# EAGLE schematic ETEST01 (EAGLE 7.3.0)

## Sheet 1 of 2
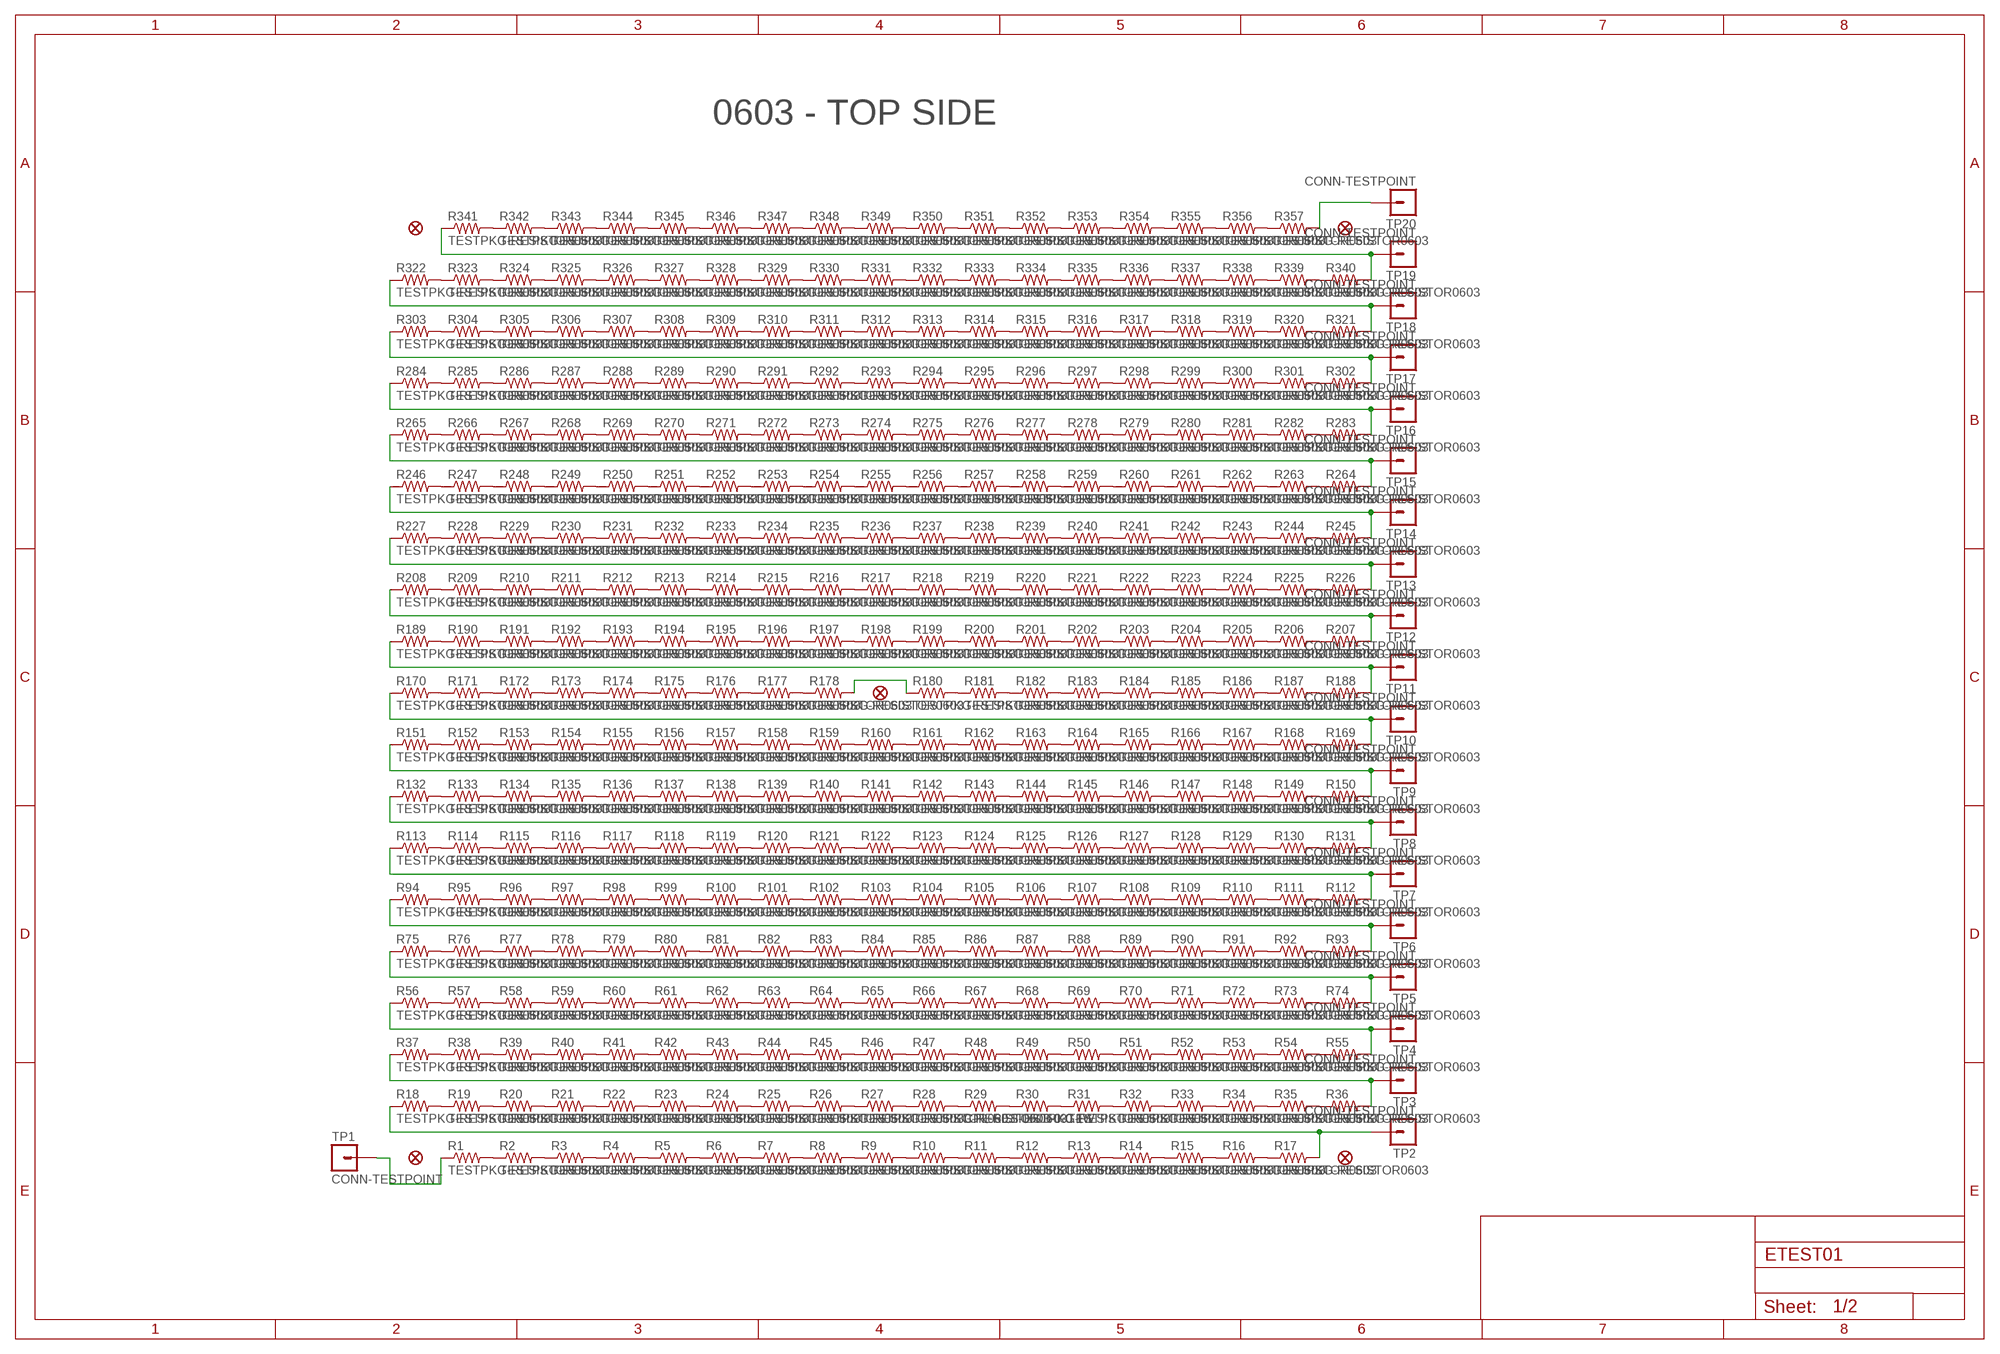
[diagram p0: schematic, sheet 1]

### Parts
FID1  FIDUCIAL  [FIDUCIAL]
FID2  FIDUCIAL  [FIDUCIAL]
FID3  FIDUCIAL  [FIDUCIAL]
FID4  FIDUCIAL  [FIDUCIAL]
FID5  FIDUCIAL  [FIDUCIAL]
R1  TESTPKG-RESISTOR0603  [TESTPKG-R0603]
R2  TESTPKG-RESISTOR0603  [TESTPKG-R0603]
R3  TESTPKG-RESISTOR0603  [TESTPKG-R0603]
R4  TESTPKG-RESISTOR0603  [TESTPKG-R0603]
R5  TESTPKG-RESISTOR0603  [TESTPKG-R0603]
R6  TESTPKG-RESISTOR0603  [TESTPKG-R0603]
R7  TESTPKG-RESISTOR0603  [TESTPKG-R0603]
R8  TESTPKG-RESISTOR0603  [TESTPKG-R0603]
R9  TESTPKG-RESISTOR0603  [TESTPKG-R0603]
R10  TESTPKG-RESISTOR0603  [TESTPKG-R0603]
R11  TESTPKG-RESISTOR0603  [TESTPKG-R0603]
R12  TESTPKG-RESISTOR0603  [TESTPKG-R0603]
R13  TESTPKG-RESISTOR0603  [TESTPKG-R0603]
R14  TESTPKG-RESISTOR0603  [TESTPKG-R0603]
R15  TESTPKG-RESISTOR0603  [TESTPKG-R0603]
R16  TESTPKG-RESISTOR0603  [TESTPKG-R0603]
R17  TESTPKG-RESISTOR0603  [TESTPKG-R0603]
R18  TESTPKG-RESISTOR0603  [TESTPKG-R0603]
R19  TESTPKG-RESISTOR0603  [TESTPKG-R0603]
R20  TESTPKG-RESISTOR0603  [TESTPKG-R0603]
R21  TESTPKG-RESISTOR0603  [TESTPKG-R0603]
R22  TESTPKG-RESISTOR0603  [TESTPKG-R0603]
R23  TESTPKG-RESISTOR0603  [TESTPKG-R0603]
R24  TESTPKG-RESISTOR0603  [TESTPKG-R0603]
R25  TESTPKG-RESISTOR0603  [TESTPKG-R0603]
R26  TESTPKG-RESISTOR0603  [TESTPKG-R0603]
R27  TESTPKG-RESISTOR0603  [TESTPKG-R0603]
R28  TESTPKG-RESISTOR0603  [TESTPKG-R0603]
R29  CPL-RES-0603-0-0.1W  [R0603]
R30  TESTPKG-RESISTOR0603  [TESTPKG-R0603]
R31  TESTPKG-RESISTOR0603  [TESTPKG-R0603]
R32  TESTPKG-RESISTOR0603  [TESTPKG-R0603]
R33  TESTPKG-RESISTOR0603  [TESTPKG-R0603]
R34  TESTPKG-RESISTOR0603  [TESTPKG-R0603]
R35  TESTPKG-RESISTOR0603  [TESTPKG-R0603]
R36  TESTPKG-RESISTOR0603  [TESTPKG-R0603]
R37  TESTPKG-RESISTOR0603  [TESTPKG-R0603]
R38  TESTPKG-RESISTOR0603  [TESTPKG-R0603]
R39  TESTPKG-RESISTOR0603  [TESTPKG-R0603]
R40  TESTPKG-RESISTOR0603  [TESTPKG-R0603]
R41  TESTPKG-RESISTOR0603  [TESTPKG-R0603]
R42  TESTPKG-RESISTOR0603  [TESTPKG-R0603]
R43  TESTPKG-RESISTOR0603  [TESTPKG-R0603]
R44  TESTPKG-RESISTOR0603  [TESTPKG-R0603]
R45  TESTPKG-RESISTOR0603  [TESTPKG-R0603]
R46  TESTPKG-RESISTOR0603  [TESTPKG-R0603]
R47  TESTPKG-RESISTOR0603  [TESTPKG-R0603]
R48  TESTPKG-RESISTOR0603  [TESTPKG-R0603]
R49  TESTPKG-RESISTOR0603  [TESTPKG-R0603]
R50  TESTPKG-RESISTOR0603  [TESTPKG-R0603]
R51  TESTPKG-RESISTOR0603  [TESTPKG-R0603]
R52  TESTPKG-RESISTOR0603  [TESTPKG-R0603]
R53  TESTPKG-RESISTOR0603  [TESTPKG-R0603]
R54  TESTPKG-RESISTOR0603  [TESTPKG-R0603]
R55  TESTPKG-RESISTOR0603  [TESTPKG-R0603]
R56  TESTPKG-RESISTOR0603  [TESTPKG-R0603]
R57  TESTPKG-RESISTOR0603  [TESTPKG-R0603]
R58  TESTPKG-RESISTOR0603  [TESTPKG-R0603]
R59  TESTPKG-RESISTOR0603  [TESTPKG-R0603]
R60  TESTPKG-RESISTOR0603  [TESTPKG-R0603]
R61  TESTPKG-RESISTOR0603  [TESTPKG-R0603]
R62  TESTPKG-RESISTOR0603  [TESTPKG-R0603]
R63  TESTPKG-RESISTOR0603  [TESTPKG-R0603]
R64  TESTPKG-RESISTOR0603  [TESTPKG-R0603]
R65  TESTPKG-RESISTOR0603  [TESTPKG-R0603]
R66  TESTPKG-RESISTOR0603  [TESTPKG-R0603]
R67  TESTPKG-RESISTOR0603  [TESTPKG-R0603]
R68  TESTPKG-RESISTOR0603  [TESTPKG-R0603]
R69  TESTPKG-RESISTOR0603  [TESTPKG-R0603]
R70  TESTPKG-RESISTOR0603  [TESTPKG-R0603]
R71  TESTPKG-RESISTOR0603  [TESTPKG-R0603]
R72  TESTPKG-RESISTOR0603  [TESTPKG-R0603]
R73  TESTPKG-RESISTOR0603  [TESTPKG-R0603]
R74  TESTPKG-RESISTOR0603  [TESTPKG-R0603]
R75  TESTPKG-RESISTOR0603  [TESTPKG-R0603]
R76  TESTPKG-RESISTOR0603  [TESTPKG-R0603]
R77  TESTPKG-RESISTOR0603  [TESTPKG-R0603]
R78  TESTPKG-RESISTOR0603  [TESTPKG-R0603]
R79  TESTPKG-RESISTOR0603  [TESTPKG-R0603]
R80  TESTPKG-RESISTOR0603  [TESTPKG-R0603]
R81  TESTPKG-RESISTOR0603  [TESTPKG-R0603]
R82  TESTPKG-RESISTOR0603  [TESTPKG-R0603]
R83  TESTPKG-RESISTOR0603  [TESTPKG-R0603]
R84  TESTPKG-RESISTOR0603  [TESTPKG-R0603]
R85  TESTPKG-RESISTOR0603  [TESTPKG-R0603]
R86  TESTPKG-RESISTOR0603  [TESTPKG-R0603]
R87  TESTPKG-RESISTOR0603  [TESTPKG-R0603]
R88  TESTPKG-RESISTOR0603  [TESTPKG-R0603]
R89  TESTPKG-RESISTOR0603  [TESTPKG-R0603]
R90  TESTPKG-RESISTOR0603  [TESTPKG-R0603]
R91  TESTPKG-RESISTOR0603  [TESTPKG-R0603]
R92  TESTPKG-RESISTOR0603  [TESTPKG-R0603]
R93  TESTPKG-RESISTOR0603  [TESTPKG-R0603]
R94  TESTPKG-RESISTOR0603  [TESTPKG-R0603]
R95  TESTPKG-RESISTOR0603  [TESTPKG-R0603]
R96  TESTPKG-RESISTOR0603  [TESTPKG-R0603]
R97  TESTPKG-RESISTOR0603  [TESTPKG-R0603]
R98  TESTPKG-RESISTOR0603  [TESTPKG-R0603]
R99  TESTPKG-RESISTOR0603  [TESTPKG-R0603]
R100  TESTPKG-RESISTOR0603  [TESTPKG-R0603]
R101  TESTPKG-RESISTOR0603  [TESTPKG-R0603]
R102  TESTPKG-RESISTOR0603  [TESTPKG-R0603]
R103  TESTPKG-RESISTOR0603  [TESTPKG-R0603]
R104  TESTPKG-RESISTOR0603  [TESTPKG-R0603]
R105  TESTPKG-RESISTOR0603  [TESTPKG-R0603]
R106  TESTPKG-RESISTOR0603  [TESTPKG-R0603]
R107  TESTPKG-RESISTOR0603  [TESTPKG-R0603]
R108  TESTPKG-RESISTOR0603  [TESTPKG-R0603]
R109  TESTPKG-RESISTOR0603  [TESTPKG-R0603]
R110  TESTPKG-RESISTOR0603  [TESTPKG-R0603]
R111  TESTPKG-RESISTOR0603  [TESTPKG-R0603]
R112  TESTPKG-RESISTOR0603  [TESTPKG-R0603]
R113  TESTPKG-RESISTOR0603  [TESTPKG-R0603]
R114  TESTPKG-RESISTOR0603  [TESTPKG-R0603]
R115  TESTPKG-RESISTOR0603  [TESTPKG-R0603]
R116  TESTPKG-RESISTOR0603  [TESTPKG-R0603]
R117  TESTPKG-RESISTOR0603  [TESTPKG-R0603]
R118  TESTPKG-RESISTOR0603  [TESTPKG-R0603]
R119  TESTPKG-RESISTOR0603  [TESTPKG-R0603]
R120  TESTPKG-RESISTOR0603  [TESTPKG-R0603]
R121  TESTPKG-RESISTOR0603  [TESTPKG-R0603]
R122  TESTPKG-RESISTOR0603  [TESTPKG-R0603]
R123  TESTPKG-RESISTOR0603  [TESTPKG-R0603]
R124  TESTPKG-RESISTOR0603  [TESTPKG-R0603]
R125  TESTPKG-RESISTOR0603  [TESTPKG-R0603]
R126  TESTPKG-RESISTOR0603  [TESTPKG-R0603]
R127  TESTPKG-RESISTOR0603  [TESTPKG-R0603]
R128  TESTPKG-RESISTOR0603  [TESTPKG-R0603]
R129  TESTPKG-RESISTOR0603  [TESTPKG-R0603]
R130  TESTPKG-RESISTOR0603  [TESTPKG-R0603]
R131  TESTPKG-RESISTOR0603  [TESTPKG-R0603]
R132  TESTPKG-RESISTOR0603  [TESTPKG-R0603]
R133  TESTPKG-RESISTOR0603  [TESTPKG-R0603]
R134  TESTPKG-RESISTOR0603  [TESTPKG-R0603]
R135  TESTPKG-RESISTOR0603  [TESTPKG-R0603]
R136  TESTPKG-RESISTOR0603  [TESTPKG-R0603]
R137  TESTPKG-RESISTOR0603  [TESTPKG-R0603]
R138  TESTPKG-RESISTOR0603  [TESTPKG-R0603]
R139  TESTPKG-RESISTOR0603  [TESTPKG-R0603]
R140  TESTPKG-RESISTOR0603  [TESTPKG-R0603]
R141  TESTPKG-RESISTOR0603  [TESTPKG-R0603]
R142  TESTPKG-RESISTOR0603  [TESTPKG-R0603]
R143  TESTPKG-RESISTOR0603  [TESTPKG-R0603]
R144  TESTPKG-RESISTOR0603  [TESTPKG-R0603]
R145  TESTPKG-RESISTOR0603  [TESTPKG-R0603]
R146  TESTPKG-RESISTOR0603  [TESTPKG-R0603]
R147  TESTPKG-RESISTOR0603  [TESTPKG-R0603]
R148  TESTPKG-RESISTOR0603  [TESTPKG-R0603]
R149  TESTPKG-RESISTOR0603  [TESTPKG-R0603]
R150  TESTPKG-RESISTOR0603  [TESTPKG-R0603]
R151  TESTPKG-RESISTOR0603  [TESTPKG-R0603]
R152  TESTPKG-RESISTOR0603  [TESTPKG-R0603]
R153  TESTPKG-RESISTOR0603  [TESTPKG-R0603]
R154  TESTPKG-RESISTOR0603  [TESTPKG-R0603]
R155  TESTPKG-RESISTOR0603  [TESTPKG-R0603]
R156  TESTPKG-RESISTOR0603  [TESTPKG-R0603]
R157  TESTPKG-RESISTOR0603  [TESTPKG-R0603]
R158  TESTPKG-RESISTOR0603  [TESTPKG-R0603]
R159  TESTPKG-RESISTOR0603  [TESTPKG-R0603]
R160  TESTPKG-RESISTOR0603  [TESTPKG-R0603]
R161  TESTPKG-RESISTOR0603  [TESTPKG-R0603]
R162  TESTPKG-RESISTOR0603  [TESTPKG-R0603]
R163  TESTPKG-RESISTOR0603  [TESTPKG-R0603]
R164  TESTPKG-RESISTOR0603  [TESTPKG-R0603]
R165  TESTPKG-RESISTOR0603  [TESTPKG-R0603]
R166  TESTPKG-RESISTOR0603  [TESTPKG-R0603]
R167  TESTPKG-RESISTOR0603  [TESTPKG-R0603]
R168  TESTPKG-RESISTOR0603  [TESTPKG-R0603]
R169  TESTPKG-RESISTOR0603  [TESTPKG-R0603]
R170  TESTPKG-RESISTOR0603  [TESTPKG-R0603]
R171  TESTPKG-RESISTOR0603  [TESTPKG-R0603]
R172  TESTPKG-RESISTOR0603  [TESTPKG-R0603]
R173  TESTPKG-RESISTOR0603  [TESTPKG-R0603]
R174  TESTPKG-RESISTOR0603  [TESTPKG-R0603]
R175  TESTPKG-RESISTOR0603  [TESTPKG-R0603]
R176  TESTPKG-RESISTOR0603  [TESTPKG-R0603]
R177  TESTPKG-RESISTOR0603  [TESTPKG-R0603]
R178  TESTPKG-RESISTOR0603  [TESTPKG-R0603]
R180  TESTPKG-RESISTOR0603  [TESTPKG-R0603]
R181  TESTPKG-RESISTOR0603  [TESTPKG-R0603]
R182  TESTPKG-RESISTOR0603  [TESTPKG-R0603]
R183  TESTPKG-RESISTOR0603  [TESTPKG-R0603]
R184  TESTPKG-RESISTOR0603  [TESTPKG-R0603]
R185  TESTPKG-RESISTOR0603  [TESTPKG-R0603]
R186  TESTPKG-RESISTOR0603  [TESTPKG-R0603]
R187  TESTPKG-RESISTOR0603  [TESTPKG-R0603]
R188  TESTPKG-RESISTOR0603  [TESTPKG-R0603]
R189  TESTPKG-RESISTOR0603  [TESTPKG-R0603]
R190  TESTPKG-RESISTOR0603  [TESTPKG-R0603]
R191  TESTPKG-RESISTOR0603  [TESTPKG-R0603]
R192  TESTPKG-RESISTOR0603  [TESTPKG-R0603]
R193  TESTPKG-RESISTOR0603  [TESTPKG-R0603]
R194  TESTPKG-RESISTOR0603  [TESTPKG-R0603]
R195  TESTPKG-RESISTOR0603  [TESTPKG-R0603]
R196  TESTPKG-RESISTOR0603  [TESTPKG-R0603]
R197  TESTPKG-RESISTOR0603  [TESTPKG-R0603]
R198  TESTPKG-RESISTOR0603  [TESTPKG-R0603]
R199  TESTPKG-RESISTOR0603  [TESTPKG-R0603]
R200  TESTPKG-RESISTOR0603  [TESTPKG-R0603]
R201  TESTPKG-RESISTOR0603  [TESTPKG-R0603]
R202  TESTPKG-RESISTOR0603  [TESTPKG-R0603]
R203  TESTPKG-RESISTOR0603  [TESTPKG-R0603]
R204  TESTPKG-RESISTOR0603  [TESTPKG-R0603]
R205  TESTPKG-RESISTOR0603  [TESTPKG-R0603]
R206  TESTPKG-RESISTOR0603  [TESTPKG-R0603]
R207  TESTPKG-RESISTOR0603  [TESTPKG-R0603]
R208  TESTPKG-RESISTOR0603  [TESTPKG-R0603]
R209  TESTPKG-RESISTOR0603  [TESTPKG-R0603]
R210  TESTPKG-RESISTOR0603  [TESTPKG-R0603]
R211  TESTPKG-RESISTOR0603  [TESTPKG-R0603]
R212  TESTPKG-RESISTOR0603  [TESTPKG-R0603]
R213  TESTPKG-RESISTOR0603  [TESTPKG-R0603]
R214  TESTPKG-RESISTOR0603  [TESTPKG-R0603]
R215  TESTPKG-RESISTOR0603  [TESTPKG-R0603]
R216  TESTPKG-RESISTOR0603  [TESTPKG-R0603]
R217  TESTPKG-RESISTOR0603  [TESTPKG-R0603]
R218  TESTPKG-RESISTOR0603  [TESTPKG-R0603]
R219  TESTPKG-RESISTOR0603  [TESTPKG-R0603]
R220  TESTPKG-RESISTOR0603  [TESTPKG-R0603]
R221  TESTPKG-RESISTOR0603  [TESTPKG-R0603]
R222  TESTPKG-RESISTOR0603  [TESTPKG-R0603]
R223  TESTPKG-RESISTOR0603  [TESTPKG-R0603]
R224  TESTPKG-RESISTOR0603  [TESTPKG-R0603]
R225  TESTPKG-RESISTOR0603  [TESTPKG-R0603]
R226  TESTPKG-RESISTOR0603  [TESTPKG-R0603]
R227  TESTPKG-RESISTOR0603  [TESTPKG-R0603]
R228  TESTPKG-RESISTOR0603  [TESTPKG-R0603]
R229  TESTPKG-RESISTOR0603  [TESTPKG-R0603]
R230  TESTPKG-RESISTOR0603  [TESTPKG-R0603]
R231  TESTPKG-RESISTOR0603  [TESTPKG-R0603]
R232  TESTPKG-RESISTOR0603  [TESTPKG-R0603]
R233  TESTPKG-RESISTOR0603  [TESTPKG-R0603]
R234  TESTPKG-RESISTOR0603  [TESTPKG-R0603]
R235  TESTPKG-RESISTOR0603  [TESTPKG-R0603]
R236  TESTPKG-RESISTOR0603  [TESTPKG-R0603]
R237  TESTPKG-RESISTOR0603  [TESTPKG-R0603]
R238  TESTPKG-RESISTOR0603  [TESTPKG-R0603]
R239  TESTPKG-RESISTOR0603  [TESTPKG-R0603]
R240  TESTPKG-RESISTOR0603  [TESTPKG-R0603]
R241  TESTPKG-RESISTOR0603  [TESTPKG-R0603]
R242  TESTPKG-RESISTOR0603  [TESTPKG-R0603]
R243  TESTPKG-RESISTOR0603  [TESTPKG-R0603]
R244  TESTPKG-RESISTOR0603  [TESTPKG-R0603]
R245  TESTPKG-RESISTOR0603  [TESTPKG-R0603]
R246  TESTPKG-RESISTOR0603  [TESTPKG-R0603]
R247  TESTPKG-RESISTOR0603  [TESTPKG-R0603]
R248  TESTPKG-RESISTOR0603  [TESTPKG-R0603]
R249  TESTPKG-RESISTOR0603  [TESTPKG-R0603]
R250  TESTPKG-RESISTOR0603  [TESTPKG-R0603]
R251  TESTPKG-RESISTOR0603  [TESTPKG-R0603]
R252  TESTPKG-RESISTOR0603  [TESTPKG-R0603]
R253  TESTPKG-RESISTOR0603  [TESTPKG-R0603]
R254  TESTPKG-RESISTOR0603  [TESTPKG-R0603]
R255  TESTPKG-RESISTOR0603  [TESTPKG-R0603]
R256  TESTPKG-RESISTOR0603  [TESTPKG-R0603]
R257  TESTPKG-RESISTOR0603  [TESTPKG-R0603]
R258  TESTPKG-RESISTOR0603  [TESTPKG-R0603]
R259  TESTPKG-RESISTOR0603  [TESTPKG-R0603]
R260  TESTPKG-RESISTOR0603  [TESTPKG-R0603]
R261  TESTPKG-RESISTOR0603  [TESTPKG-R0603]
R262  TESTPKG-RESISTOR0603  [TESTPKG-R0603]
R263  TESTPKG-RESISTOR0603  [TESTPKG-R0603]
R264  TESTPKG-RESISTOR0603  [TESTPKG-R0603]
R265  TESTPKG-RESISTOR0603  [TESTPKG-R0603]
R266  TESTPKG-RESISTOR0603  [TESTPKG-R0603]
R267  TESTPKG-RESISTOR0603  [TESTPKG-R0603]
R268  TESTPKG-RESISTOR0603  [TESTPKG-R0603]
R269  TESTPKG-RESISTOR0603  [TESTPKG-R0603]
R270  TESTPKG-RESISTOR0603  [TESTPKG-R0603]
R271  TESTPKG-RESISTOR0603  [TESTPKG-R0603]
R272  TESTPKG-RESISTOR0603  [TESTPKG-R0603]
R273  TESTPKG-RESISTOR0603  [TESTPKG-R0603]
R274  TESTPKG-RESISTOR0603  [TESTPKG-R0603]
R275  TESTPKG-RESISTOR0603  [TESTPKG-R0603]
R276  TESTPKG-RESISTOR0603  [TESTPKG-R0603]
R277  TESTPKG-RESISTOR0603  [TESTPKG-R0603]
R278  TESTPKG-RESISTOR0603  [TESTPKG-R0603]
R279  TESTPKG-RESISTOR0603  [TESTPKG-R0603]
R280  TESTPKG-RESISTOR0603  [TESTPKG-R0603]
R281  TESTPKG-RESISTOR0603  [TESTPKG-R0603]
R282  TESTPKG-RESISTOR0603  [TESTPKG-R0603]
R283  TESTPKG-RESISTOR0603  [TESTPKG-R0603]
R284  TESTPKG-RESISTOR0603  [TESTPKG-R0603]
R285  TESTPKG-RESISTOR0603  [TESTPKG-R0603]
R286  TESTPKG-RESISTOR0603  [TESTPKG-R0603]
R287  TESTPKG-RESISTOR0603  [TESTPKG-R0603]
R288  TESTPKG-RESISTOR0603  [TESTPKG-R0603]
R289  TESTPKG-RESISTOR0603  [TESTPKG-R0603]
R290  TESTPKG-RESISTOR0603  [TESTPKG-R0603]
R291  TESTPKG-RESISTOR0603  [TESTPKG-R0603]
R292  TESTPKG-RESISTOR0603  [TESTPKG-R0603]
R293  TESTPKG-RESISTOR0603  [TESTPKG-R0603]
R294  TESTPKG-RESISTOR0603  [TESTPKG-R0603]
R295  TESTPKG-RESISTOR0603  [TESTPKG-R0603]
R296  TESTPKG-RESISTOR0603  [TESTPKG-R0603]
R297  TESTPKG-RESISTOR0603  [TESTPKG-R0603]
R298  TESTPKG-RESISTOR0603  [TESTPKG-R0603]
R299  TESTPKG-RESISTOR0603  [TESTPKG-R0603]
R300  TESTPKG-RESISTOR0603  [TESTPKG-R0603]
R301  TESTPKG-RESISTOR0603  [TESTPKG-R0603]
R302  TESTPKG-RESISTOR0603  [TESTPKG-R0603]
R303  TESTPKG-RESISTOR0603  [TESTPKG-R0603]
R304  TESTPKG-RESISTOR0603  [TESTPKG-R0603]
R305  TESTPKG-RESISTOR0603  [TESTPKG-R0603]
R306  TESTPKG-RESISTOR0603  [TESTPKG-R0603]
R307  TESTPKG-RESISTOR0603  [TESTPKG-R0603]
R308  TESTPKG-RESISTOR0603  [TESTPKG-R0603]
R309  TESTPKG-RESISTOR0603  [TESTPKG-R0603]
R310  TESTPKG-RESISTOR0603  [TESTPKG-R0603]
R311  TESTPKG-RESISTOR0603  [TESTPKG-R0603]
R312  TESTPKG-RESISTOR0603  [TESTPKG-R0603]
R313  TESTPKG-RESISTOR0603  [TESTPKG-R0603]
R314  TESTPKG-RESISTOR0603  [TESTPKG-R0603]
R315  TESTPKG-RESISTOR0603  [TESTPKG-R0603]
R316  TESTPKG-RESISTOR0603  [TESTPKG-R0603]
R317  TESTPKG-RESISTOR0603  [TESTPKG-R0603]
R318  TESTPKG-RESISTOR0603  [TESTPKG-R0603]
R319  TESTPKG-RESISTOR0603  [TESTPKG-R0603]
R320  TESTPKG-RESISTOR0603  [TESTPKG-R0603]
R321  TESTPKG-RESISTOR0603  [TESTPKG-R0603]
R322  TESTPKG-RESISTOR0603  [TESTPKG-R0603]
R323  TESTPKG-RESISTOR0603  [TESTPKG-R0603]
R324  TESTPKG-RESISTOR0603  [TESTPKG-R0603]
R325  TESTPKG-RESISTOR0603  [TESTPKG-R0603]
R326  TESTPKG-RESISTOR0603  [TESTPKG-R0603]
R327  TESTPKG-RESISTOR0603  [TESTPKG-R0603]
R328  TESTPKG-RESISTOR0603  [TESTPKG-R0603]
R329  TESTPKG-RESISTOR0603  [TESTPKG-R0603]
R330  TESTPKG-RESISTOR0603  [TESTPKG-R0603]
R331  TESTPKG-RESISTOR0603  [TESTPKG-R0603]
R332  TESTPKG-RESISTOR0603  [TESTPKG-R0603]
R333  TESTPKG-RESISTOR0603  [TESTPKG-R0603]
R334  TESTPKG-RESISTOR0603  [TESTPKG-R0603]
R335  TESTPKG-RESISTOR0603  [TESTPKG-R0603]
R336  TESTPKG-RESISTOR0603  [TESTPKG-R0603]
R337  TESTPKG-RESISTOR0603  [TESTPKG-R0603]
R338  TESTPKG-RESISTOR0603  [TESTPKG-R0603]
R339  TESTPKG-RESISTOR0603  [TESTPKG-R0603]
R340  TESTPKG-RESISTOR0603  [TESTPKG-R0603]
R341  TESTPKG-RESISTOR0603  [TESTPKG-R0603]
R342  TESTPKG-RESISTOR0603  [TESTPKG-R0603]
R343  TESTPKG-RESISTOR0603  [TESTPKG-R0603]
R344  TESTPKG-RESISTOR0603  [TESTPKG-R0603]
R345  TESTPKG-RESISTOR0603  [TESTPKG-R0603]
R346  TESTPKG-RESISTOR0603  [TESTPKG-R0603]
R347  TESTPKG-RESISTOR0603  [TESTPKG-R0603]
R348  TESTPKG-RESISTOR0603  [TESTPKG-R0603]
R349  TESTPKG-RESISTOR0603  [TESTPKG-R0603]
R350  TESTPKG-RESISTOR0603  [TESTPKG-R0603]
R351  TESTPKG-RESISTOR0603  [TESTPKG-R0603]
R352  TESTPKG-RESISTOR0603  [TESTPKG-R0603]
R353  TESTPKG-RESISTOR0603  [TESTPKG-R0603]
R354  TESTPKG-RESISTOR0603  [TESTPKG-R0603]
R355  TESTPKG-RESISTOR0603  [TESTPKG-R0603]
R356  TESTPKG-RESISTOR0603  [TESTPKG-R0603]
R357  TESTPKG-RESISTOR0603  [TESTPKG-R0603]
TP1  CONN-TESTPOINT  [CON-TESTPOINT]
TP2  CONN-TESTPOINT  [CON-TESTPOINT]
TP3  CONN-TESTPOINT  [CON-TESTPOINT]
TP4  CONN-TESTPOINT  [CON-TESTPOINT]
TP5  CONN-TESTPOINT  [CON-TESTPOINT]
TP6  CONN-TESTPOINT  [CON-TESTPOINT]
TP7  CONN-TESTPOINT  [CON-TESTPOINT]
TP8  CONN-TESTPOINT  [CON-TESTPOINT]
TP9  CONN-TESTPOINT  [CON-TESTPOINT]
TP10  CONN-TESTPOINT  [CON-TESTPOINT]
TP11  CONN-TESTPOINT  [CON-TESTPOINT]
TP12  CONN-TESTPOINT  [CON-TESTPOINT]
TP13  CONN-TESTPOINT  [CON-TESTPOINT]
TP14  CONN-TESTPOINT  [CON-TESTPOINT]
TP15  CONN-TESTPOINT  [CON-TESTPOINT]
TP16  CONN-TESTPOINT  [CON-TESTPOINT]
TP17  CONN-TESTPOINT  [CON-TESTPOINT]
TP18  CONN-TESTPOINT  [CON-TESTPOINT]
TP19  CONN-TESTPOINT  [CON-TESTPOINT]
TP20  CONN-TESTPOINT  [CON-TESTPOINT]

### Nets
N$1: R228.2 R229.1
N$2: R226.2 R227.1 TP13.1
N$3: R225.2 R226.1
N$4: R224.2 R225.1
N$5: R223.2 R224.1
N$6: R222.2 R223.1
N$7: R221.2 R222.1
N$8: R220.2 R221.1
N$9: R219.2 R220.1
N$10: R218.2 R219.1
N$11: R217.2 R218.1
N$12: R216.2 R217.1
N$13: R215.2 R216.1
N$14: R214.2 R215.1
N$15: R213.2 R214.1
N$16: R212.2 R213.1
N$17: R342.2 R343.1
N$18: R211.2 R212.1
N$19: R210.2 R211.1
N$20: R209.2 R210.1
N$21: R207.2 R208.1 TP12.1
N$22: R206.2 R207.1
N$23: R205.2 R206.1
N$24: R204.2 R205.1
N$25: R203.2 R204.1
N$26: R202.2 R203.1
N$27: R201.2 R202.1
N$28: R200.2 R201.1
N$29: R199.2 R200.1
N$30: R198.2 R199.1
N$31: R197.2 R198.1
N$32: R196.2 R197.1
N$33: R195.2 R196.1
N$34: R194.2 R195.1
N$35: R193.2 R194.1
N$36: R192.2 R193.1
N$37: R191.2 R192.1
N$38: R190.2 R191.1
N$39: R188.2 R189.1 TP11.1
N$40: R187.2 R188.1
N$41: R186.2 R187.1
N$42: R185.2 R186.1
N$43: R184.2 R185.1
N$44: R183.2 R184.1
N$45: R182.2 R183.1
N$46: R181.2 R182.1
N$47: R180.2 R181.1
N$48: R178.2 R180.1
N$49: R357.2 TP20.1
N$50: R177.2 R178.1
N$51: R176.2 R177.1
N$52: R175.2 R176.1
N$53: R174.2 R175.1
N$54: R173.2 R174.1
N$55: R172.2 R173.1
N$56: R171.2 R172.1
N$57: R169.2 R170.1 TP10.1
N$58: R168.2 R169.1
N$59: R167.2 R168.1
N$60: R166.2 R167.1
N$61: R165.2 R166.1
N$62: R164.2 R165.1
N$63: R163.2 R164.1
N$64: R162.2 R163.1
N$65: R161.2 R162.1
N$66: R160.2 R161.1
N$67: R159.2 R160.1
N$68: R158.2 R159.1
N$69: R157.2 R158.1
N$70: R156.2 R157.1
N$71: R155.2 R156.1
N$72: R154.2 R155.1
N$73: R153.2 R154.1
N$74: R152.2 R153.1
N$75: R150.2 R151.1 TP9.1
N$76: R149.2 R150.1
N$77: R148.2 R149.1
N$78: R147.2 R148.1
N$79: R146.2 R147.1
N$80: R145.2 R146.1
N$81: R144.2 R145.1
N$82: R143.2 R144.1
N$83: R142.2 R143.1
N$84: R141.2 R142.1
N$85: R140.2 R141.1
N$86: R139.2 R140.1
N$87: R138.2 R139.1
N$88: R137.2 R138.1
N$89: R136.2 R137.1
N$90: R135.2 R136.1
N$91: R134.2 R135.1
N$92: R133.2 R134.1
N$93: R131.2 R132.1 TP8.1
N$94: R130.2 R131.1
N$95: R129.2 R130.1
N$96: R128.2 R129.1
N$97: R127.2 R128.1
N$98: R126.2 R127.1
N$99: R125.2 R126.1
N$100: R124.2 R125.1
N$101: R123.2 R124.1
N$102: R122.2 R123.1
N$103: R121.2 R122.1
N$104: R120.2 R121.1
N$105: R119.2 R120.1
N$106: R118.2 R119.1
N$107: R117.2 R118.1
N$108: R116.2 R117.1
N$109: R115.2 R116.1
N$110: R114.2 R115.1
N$111: R112.2 R113.1 TP7.1
N$112: R111.2 R112.1
N$113: R110.2 R111.1
N$114: R109.2 R110.1
N$115: R108.2 R109.1
N$116: R107.2 R108.1
N$117: R106.2 R107.1
N$118: R105.2 R106.1
N$119: R104.2 R105.1
N$120: R103.2 R104.1
N$121: R102.2 R103.1
N$122: R101.2 R102.1
N$123: R100.2 R101.1
N$124: R99.2 R100.1
N$125: R98.2 R99.1
N$126: R97.2 R98.1
N$127: R96.2 R97.1
N$128: R95.2 R96.1
N$129: R93.2 R94.1 TP6.1
N$130: R92.2 R93.1
N$131: R91.2 R92.1
N$132: R90.2 R91.1
N$133: R89.2 R90.1
N$134: R88.2 R89.1
N$135: R87.2 R88.1
N$136: R86.2 R87.1
N$137: R85.2 R86.1
N$138: R84.2 R85.1
N$139: R83.2 R84.1
N$140: R82.2 R83.1
N$141: R81.2 R82.1
N$142: R80.2 R81.1
N$143: R79.2 R80.1
N$144: R78.2 R79.1
N$145: R77.2 R78.1
N$146: R76.2 R77.1
N$147: R75.2 R76.1
N$148: R73.2 R74.1
N$149: R72.2 R73.1
N$150: R71.2 R72.1
N$151: R70.2 R71.1
N$152: R69.2 R70.1
N$153: R68.2 R69.1
N$154: R67.2 R68.1
N$155: R66.2 R67.1
N$156: R65.2 R66.1
N$157: R64.2 R65.1
N$158: R63.2 R64.1
N$159: R62.2 R63.1
N$160: R61.2 R62.1
N$161: R60.2 R61.1
N$162: R59.2 R60.1
N$163: R58.2 R59.1
N$164: R57.2 R58.1
N$165: R56.2 R57.1
N$166: R54.2 R55.1
N$167: R53.2 R54.1
N$168: R52.2 R53.1
N$169: R51.2 R52.1
N$170: R50.2 R51.1
N$171: R49.2 R50.1
N$172: R48.2 R49.1
N$173: R47.2 R48.1
N$174: R46.2 R47.1
N$175: R45.2 R46.1
N$176: R44.2 R45.1
N$177: R43.2 R44.1
N$178: R42.2 R43.1
N$179: R41.2 R42.1
N$180: R40.2 R41.1
N$181: R39.2 R40.1
N$182: R38.2 R39.1
N$183: R37.2 R38.1
N$184: R35.2 R36.1
N$185: R34.2 R35.1
N$186: R33.2 R34.1
N$187: R32.2 R33.1
N$188: R31.2 R32.1
N$189: R30.2 R31.1
N$190: R29.2 R30.1
N$191: R28.2 R29.1
N$192: R27.2 R28.1
N$193: R26.2 R27.1
N$194: R25.2 R26.1
N$195: R24.2 R25.1
N$196: R23.2 R24.1
N$197: R22.2 R23.1
N$198: R21.2 R22.1
N$199: R20.2 R21.1
N$200: R19.2 R20.1
N$201: R18.2 R19.1
N$202: R16.2 R17.1
N$203: R15.2 R16.1
N$204: R14.2 R15.1
N$205: R13.2 R14.1
N$206: R12.2 R13.1
N$207: R11.2 R12.1
N$208: R10.2 R11.1
N$209: R9.2 R10.1
N$210: R8.2 R9.1
N$211: R7.2 R8.1
N$212: R6.2 R7.1
N$213: R5.2 R6.1
N$214: R4.2 R5.1
N$215: R3.2 R4.1
N$216: R2.2 R3.1
N$217: R229.2 R230.1
N$218: R343.2 R344.1
N$219: R344.2 R345.1
N$220: R345.2 R346.1
N$221: R346.2 R347.1
N$222: R347.2 R348.1
N$223: R348.2 R349.1
N$224: R349.2 R350.1
N$225: R350.2 R351.1
N$226: R351.2 R352.1
N$227: R352.2 R353.1
N$228: R353.2 R354.1
N$229: R354.2 R355.1
N$230: R355.2 R356.1
N$231: R356.2 R357.1
N$232: R74.2 R75.1 TP5.1
N$233: R324.2 R325.1
N$234: R325.2 R326.1
N$235: R326.2 R327.1
N$236: R327.2 R328.1
N$237: R328.2 R329.1
N$238: R329.2 R330.1
N$239: R330.2 R331.1
N$240: R331.2 R332.1
N$241: R332.2 R333.1
N$242: R333.2 R334.1
N$243: R334.2 R335.1
N$244: R335.2 R336.1
N$245: R336.2 R337.1
N$246: R337.2 R338.1
N$247: R338.2 R339.1
N$248: R339.2 R340.1
N$249: R340.2 R341.1 TP19.1
N$250: R323.2 R324.1
N$251: R306.2 R307.1
N$252: R305.2 R306.1
N$253: R307.2 R308.1
N$254: R308.2 R309.1
N$255: R309.2 R310.1
N$256: R310.2 R311.1
N$257: R311.2 R312.1
N$258: R312.2 R313.1
N$259: R313.2 R314.1
N$260: R314.2 R315.1
N$261: R315.2 R316.1
N$262: R316.2 R317.1
N$263: R317.2 R318.1
N$264: R318.2 R319.1
N$265: R319.2 R320.1
N$266: R320.2 R321.1
N$267: R321.2 R322.1 TP18.1
N$268: R304.2 R305.1
N$269: R285.2 R286.1
N$270: R280.2 R281.1
N$271: R281.2 R282.1
N$272: R282.2 R283.1
N$273: R273.2 R274.1
N$274: R274.2 R275.1
N$275: R275.2 R276.1
N$276: R276.2 R277.1
N$277: R277.2 R278.1
N$278: R278.2 R279.1
N$279: R279.2 R280.1
N$280: R268.2 R269.1
N$281: R269.2 R270.1
N$282: R270.2 R271.1
N$283: R271.2 R272.1
N$284: R272.2 R273.1
N$285: R267.2 R268.1
N$286: R283.2 R284.1 TP16.1
N$287: R286.2 R287.1
N$288: R287.2 R288.1
N$289: R288.2 R289.1
N$290: R289.2 R290.1
N$291: R290.2 R291.1
N$292: R291.2 R292.1
N$293: R292.2 R293.1
N$294: R293.2 R294.1
N$295: R294.2 R295.1
N$296: R295.2 R296.1
N$297: R296.2 R297.1
N$298: R297.2 R298.1
N$299: R298.2 R299.1
N$300: R299.2 R300.1
N$301: R300.2 R301.1
N$302: R301.2 R302.1
N$303: R302.2 R303.1 TP17.1
N$304: R266.2 R267.1
N$305: R264.2 R265.1 TP15.1
N$306: R263.2 R264.1
N$307: R262.2 R263.1
N$308: R261.2 R262.1
N$309: R260.2 R261.1
N$310: R259.2 R260.1
N$311: R258.2 R259.1
N$312: R257.2 R258.1
N$313: R256.2 R257.1
N$314: R255.2 R256.1
N$315: R254.2 R255.1
N$316: R253.2 R254.1
N$317: R252.2 R253.1
N$318: R251.2 R252.1
N$319: R250.2 R251.1
N$320: R249.2 R250.1
N$321: R248.2 R249.1
N$322: R247.2 R248.1
N$323: R245.2 R246.1 TP14.1
N$324: R244.2 R245.1
N$325: R243.2 R244.1
N$326: R242.2 R243.1
N$327: R241.2 R242.1
N$328: R240.2 R241.1
N$329: R239.2 R240.1
N$330: R238.2 R239.1
N$331: R237.2 R238.1
N$332: R236.2 R237.1
N$333: R235.2 R236.1
N$334: R234.2 R235.1
N$335: R233.2 R234.1
N$336: R232.2 R233.1
N$337: R231.2 R232.1
N$338: R230.2 R231.1
N$339: R1.2 R2.1
N$340: R94.2 R95.1
N$341: R113.2 R114.1
N$342: R132.2 R133.1
N$343: R151.2 R152.1
N$344: R170.2 R171.1
N$345: R189.2 R190.1
N$346: R208.2 R209.1
N$347: R227.2 R228.1
N$348: R246.2 R247.1
N$349: R265.2 R266.1
N$350: R284.2 R285.1
N$351: R303.2 R304.1
N$352: R322.2 R323.1
N$353: R341.2 R342.1
N$354: R55.2 R56.1 TP4.1
N$355: R36.2 R37.1 TP3.1
N$356: R17.2 R18.1 TP2.1
N$357: R1.1 TP1.1

### Notes on the sheet
- 0603 - TOP SIDE

## Sheet 2 of 2
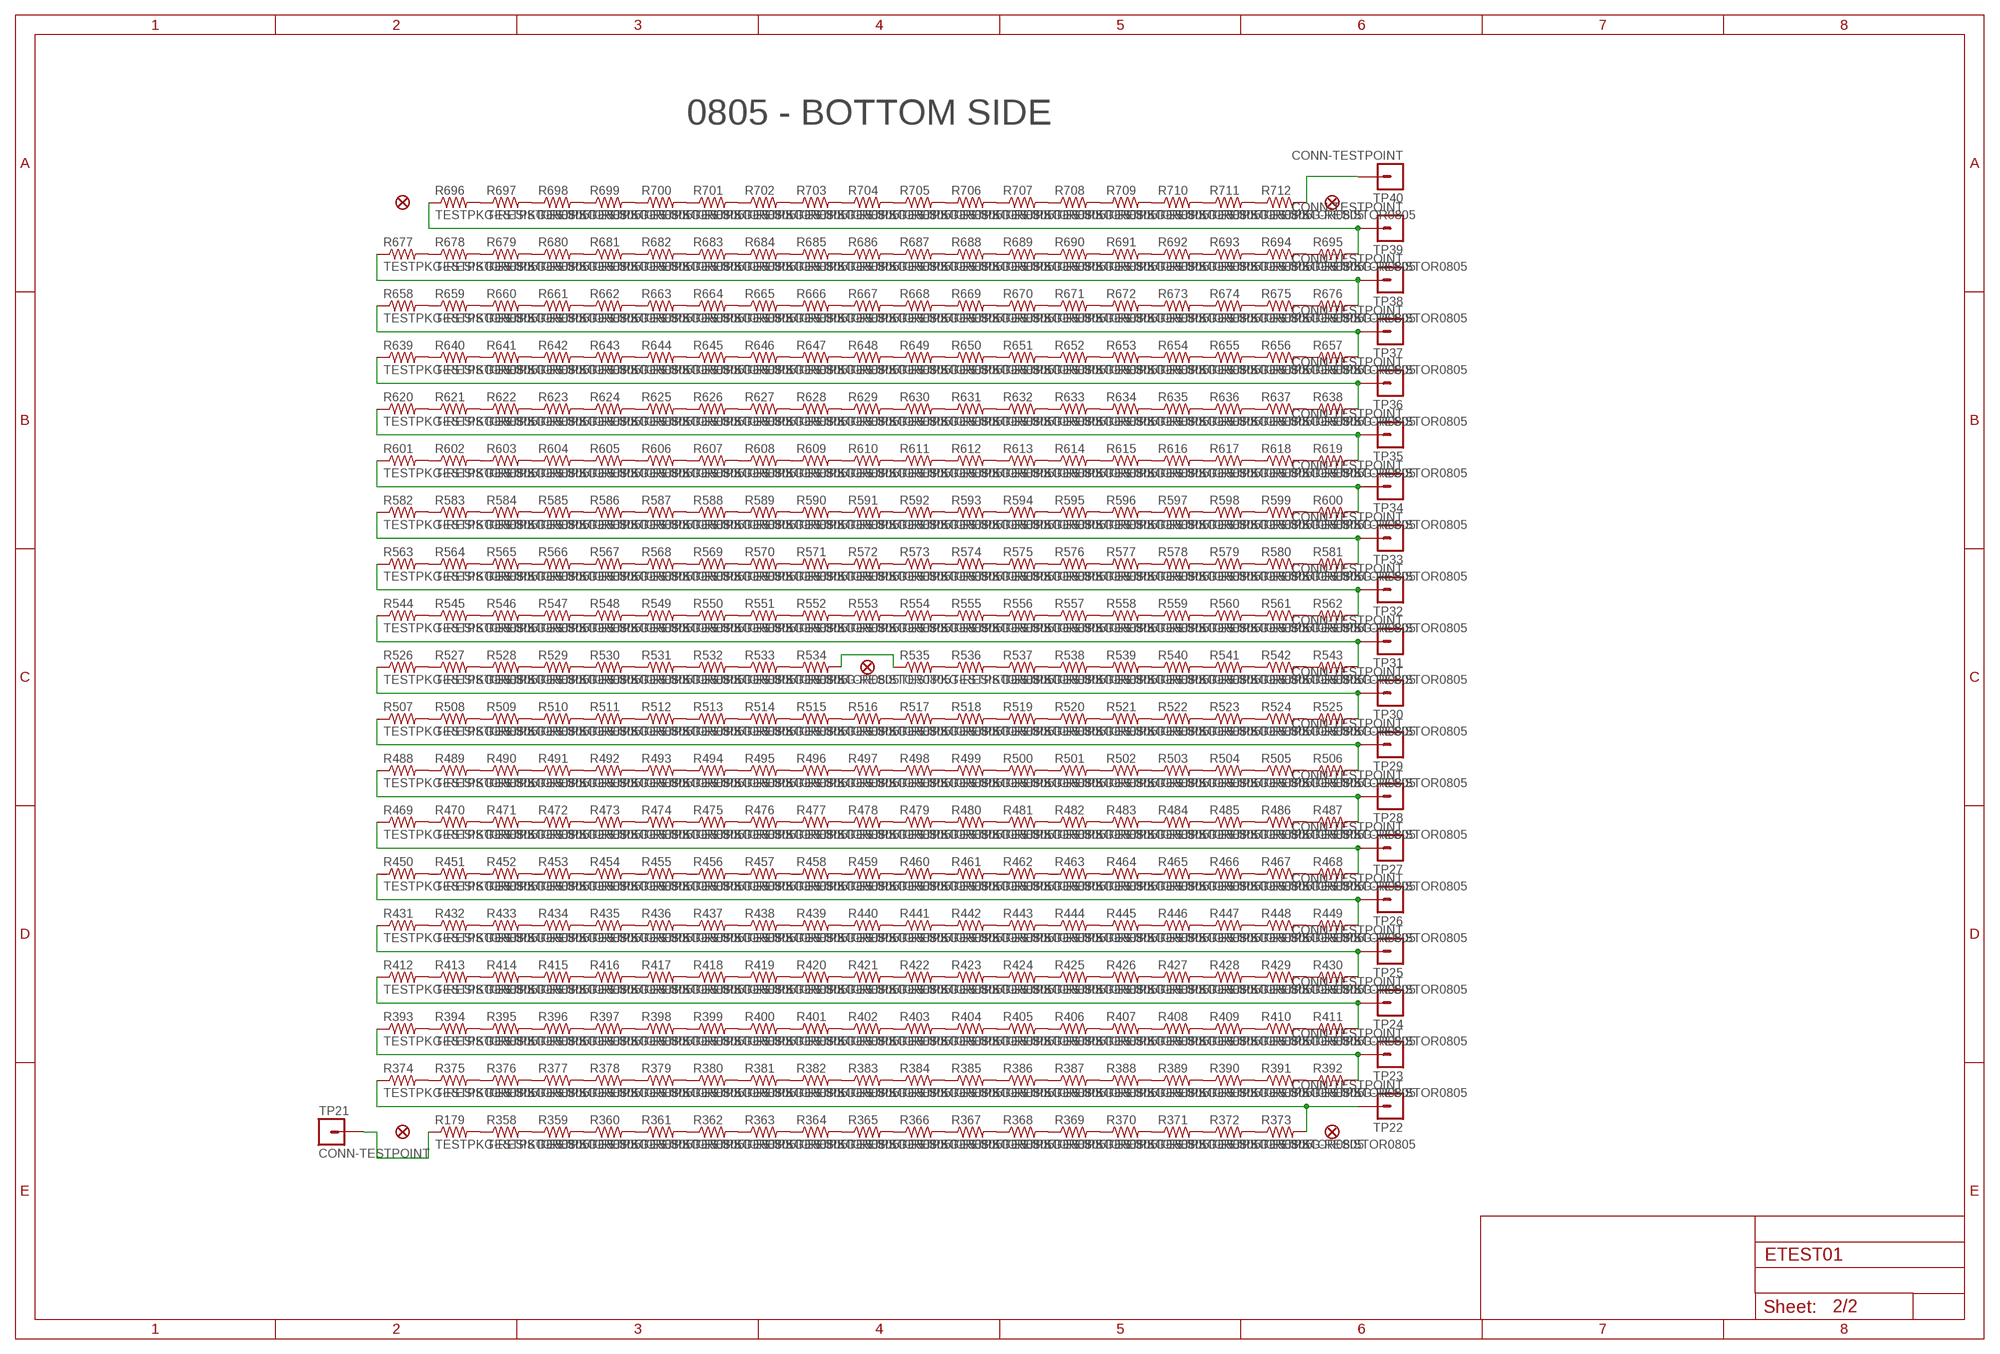
[diagram p1: schematic, sheet 2]

### Parts
FID6  FIDUCIAL  [FIDUCIAL]
FID7  FIDUCIAL  [FIDUCIAL]
FID8  FIDUCIAL  [FIDUCIAL]
FID9  FIDUCIAL  [FIDUCIAL]
FID10  FIDUCIAL  [FIDUCIAL]
R179  TESTPKG-RESISTOR0805  [TESTPKG-R0805]
R358  TESTPKG-RESISTOR0805  [TESTPKG-R0805]
R359  TESTPKG-RESISTOR0805  [TESTPKG-R0805]
R360  TESTPKG-RESISTOR0805  [TESTPKG-R0805]
R361  TESTPKG-RESISTOR0805  [TESTPKG-R0805]
R362  TESTPKG-RESISTOR0805  [TESTPKG-R0805]
R363  TESTPKG-RESISTOR0805  [TESTPKG-R0805]
R364  TESTPKG-RESISTOR0805  [TESTPKG-R0805]
R365  TESTPKG-RESISTOR0805  [TESTPKG-R0805]
R366  TESTPKG-RESISTOR0805  [TESTPKG-R0805]
R367  TESTPKG-RESISTOR0805  [TESTPKG-R0805]
R368  TESTPKG-RESISTOR0805  [TESTPKG-R0805]
R369  TESTPKG-RESISTOR0805  [TESTPKG-R0805]
R370  TESTPKG-RESISTOR0805  [TESTPKG-R0805]
R371  TESTPKG-RESISTOR0805  [TESTPKG-R0805]
R372  TESTPKG-RESISTOR0805  [TESTPKG-R0805]
R373  TESTPKG-RESISTOR0805  [TESTPKG-R0805]
R374  TESTPKG-RESISTOR0805  [TESTPKG-R0805]
R375  TESTPKG-RESISTOR0805  [TESTPKG-R0805]
R376  TESTPKG-RESISTOR0805  [TESTPKG-R0805]
R377  TESTPKG-RESISTOR0805  [TESTPKG-R0805]
R378  TESTPKG-RESISTOR0805  [TESTPKG-R0805]
R379  TESTPKG-RESISTOR0805  [TESTPKG-R0805]
R380  TESTPKG-RESISTOR0805  [TESTPKG-R0805]
R381  TESTPKG-RESISTOR0805  [TESTPKG-R0805]
R382  TESTPKG-RESISTOR0805  [TESTPKG-R0805]
R383  TESTPKG-RESISTOR0805  [TESTPKG-R0805]
R384  TESTPKG-RESISTOR0805  [TESTPKG-R0805]
R385  TESTPKG-RESISTOR0805  [TESTPKG-R0805]
R386  TESTPKG-RESISTOR0805  [TESTPKG-R0805]
R387  TESTPKG-RESISTOR0805  [TESTPKG-R0805]
R388  TESTPKG-RESISTOR0805  [TESTPKG-R0805]
R389  TESTPKG-RESISTOR0805  [TESTPKG-R0805]
R390  TESTPKG-RESISTOR0805  [TESTPKG-R0805]
R391  TESTPKG-RESISTOR0805  [TESTPKG-R0805]
R392  TESTPKG-RESISTOR0805  [TESTPKG-R0805]
R393  TESTPKG-RESISTOR0805  [TESTPKG-R0805]
R394  TESTPKG-RESISTOR0805  [TESTPKG-R0805]
R395  TESTPKG-RESISTOR0805  [TESTPKG-R0805]
R396  TESTPKG-RESISTOR0805  [TESTPKG-R0805]
R397  TESTPKG-RESISTOR0805  [TESTPKG-R0805]
R398  TESTPKG-RESISTOR0805  [TESTPKG-R0805]
R399  TESTPKG-RESISTOR0805  [TESTPKG-R0805]
R400  TESTPKG-RESISTOR0805  [TESTPKG-R0805]
R401  TESTPKG-RESISTOR0805  [TESTPKG-R0805]
R402  TESTPKG-RESISTOR0805  [TESTPKG-R0805]
R403  TESTPKG-RESISTOR0805  [TESTPKG-R0805]
R404  TESTPKG-RESISTOR0805  [TESTPKG-R0805]
R405  TESTPKG-RESISTOR0805  [TESTPKG-R0805]
R406  TESTPKG-RESISTOR0805  [TESTPKG-R0805]
R407  TESTPKG-RESISTOR0805  [TESTPKG-R0805]
R408  TESTPKG-RESISTOR0805  [TESTPKG-R0805]
R409  TESTPKG-RESISTOR0805  [TESTPKG-R0805]
R410  TESTPKG-RESISTOR0805  [TESTPKG-R0805]
R411  TESTPKG-RESISTOR0805  [TESTPKG-R0805]
R412  TESTPKG-RESISTOR0805  [TESTPKG-R0805]
R413  TESTPKG-RESISTOR0805  [TESTPKG-R0805]
R414  TESTPKG-RESISTOR0805  [TESTPKG-R0805]
R415  TESTPKG-RESISTOR0805  [TESTPKG-R0805]
R416  TESTPKG-RESISTOR0805  [TESTPKG-R0805]
R417  TESTPKG-RESISTOR0805  [TESTPKG-R0805]
R418  TESTPKG-RESISTOR0805  [TESTPKG-R0805]
R419  TESTPKG-RESISTOR0805  [TESTPKG-R0805]
R420  TESTPKG-RESISTOR0805  [TESTPKG-R0805]
R421  TESTPKG-RESISTOR0805  [TESTPKG-R0805]
R422  TESTPKG-RESISTOR0805  [TESTPKG-R0805]
R423  TESTPKG-RESISTOR0805  [TESTPKG-R0805]
R424  TESTPKG-RESISTOR0805  [TESTPKG-R0805]
R425  TESTPKG-RESISTOR0805  [TESTPKG-R0805]
R426  TESTPKG-RESISTOR0805  [TESTPKG-R0805]
R427  TESTPKG-RESISTOR0805  [TESTPKG-R0805]
R428  TESTPKG-RESISTOR0805  [TESTPKG-R0805]
R429  TESTPKG-RESISTOR0805  [TESTPKG-R0805]
R430  TESTPKG-RESISTOR0805  [TESTPKG-R0805]
R431  TESTPKG-RESISTOR0805  [TESTPKG-R0805]
R432  TESTPKG-RESISTOR0805  [TESTPKG-R0805]
R433  TESTPKG-RESISTOR0805  [TESTPKG-R0805]
R434  TESTPKG-RESISTOR0805  [TESTPKG-R0805]
R435  TESTPKG-RESISTOR0805  [TESTPKG-R0805]
R436  TESTPKG-RESISTOR0805  [TESTPKG-R0805]
R437  TESTPKG-RESISTOR0805  [TESTPKG-R0805]
R438  TESTPKG-RESISTOR0805  [TESTPKG-R0805]
R439  TESTPKG-RESISTOR0805  [TESTPKG-R0805]
R440  TESTPKG-RESISTOR0805  [TESTPKG-R0805]
R441  TESTPKG-RESISTOR0805  [TESTPKG-R0805]
R442  TESTPKG-RESISTOR0805  [TESTPKG-R0805]
R443  TESTPKG-RESISTOR0805  [TESTPKG-R0805]
R444  TESTPKG-RESISTOR0805  [TESTPKG-R0805]
R445  TESTPKG-RESISTOR0805  [TESTPKG-R0805]
R446  TESTPKG-RESISTOR0805  [TESTPKG-R0805]
R447  TESTPKG-RESISTOR0805  [TESTPKG-R0805]
R448  TESTPKG-RESISTOR0805  [TESTPKG-R0805]
R449  TESTPKG-RESISTOR0805  [TESTPKG-R0805]
R450  TESTPKG-RESISTOR0805  [TESTPKG-R0805]
R451  TESTPKG-RESISTOR0805  [TESTPKG-R0805]
R452  TESTPKG-RESISTOR0805  [TESTPKG-R0805]
R453  TESTPKG-RESISTOR0805  [TESTPKG-R0805]
R454  TESTPKG-RESISTOR0805  [TESTPKG-R0805]
R455  TESTPKG-RESISTOR0805  [TESTPKG-R0805]
R456  TESTPKG-RESISTOR0805  [TESTPKG-R0805]
R457  TESTPKG-RESISTOR0805  [TESTPKG-R0805]
R458  TESTPKG-RESISTOR0805  [TESTPKG-R0805]
R459  TESTPKG-RESISTOR0805  [TESTPKG-R0805]
R460  TESTPKG-RESISTOR0805  [TESTPKG-R0805]
R461  TESTPKG-RESISTOR0805  [TESTPKG-R0805]
R462  TESTPKG-RESISTOR0805  [TESTPKG-R0805]
R463  TESTPKG-RESISTOR0805  [TESTPKG-R0805]
R464  TESTPKG-RESISTOR0805  [TESTPKG-R0805]
R465  TESTPKG-RESISTOR0805  [TESTPKG-R0805]
R466  TESTPKG-RESISTOR0805  [TESTPKG-R0805]
R467  TESTPKG-RESISTOR0805  [TESTPKG-R0805]
R468  TESTPKG-RESISTOR0805  [TESTPKG-R0805]
R469  TESTPKG-RESISTOR0805  [TESTPKG-R0805]
R470  TESTPKG-RESISTOR0805  [TESTPKG-R0805]
R471  TESTPKG-RESISTOR0805  [TESTPKG-R0805]
R472  TESTPKG-RESISTOR0805  [TESTPKG-R0805]
R473  TESTPKG-RESISTOR0805  [TESTPKG-R0805]
R474  TESTPKG-RESISTOR0805  [TESTPKG-R0805]
R475  TESTPKG-RESISTOR0805  [TESTPKG-R0805]
R476  TESTPKG-RESISTOR0805  [TESTPKG-R0805]
R477  TESTPKG-RESISTOR0805  [TESTPKG-R0805]
R478  TESTPKG-RESISTOR0805  [TESTPKG-R0805]
R479  TESTPKG-RESISTOR0805  [TESTPKG-R0805]
R480  TESTPKG-RESISTOR0805  [TESTPKG-R0805]
R481  TESTPKG-RESISTOR0805  [TESTPKG-R0805]
R482  TESTPKG-RESISTOR0805  [TESTPKG-R0805]
R483  TESTPKG-RESISTOR0805  [TESTPKG-R0805]
R484  TESTPKG-RESISTOR0805  [TESTPKG-R0805]
R485  TESTPKG-RESISTOR0805  [TESTPKG-R0805]
R486  TESTPKG-RESISTOR0805  [TESTPKG-R0805]
R487  TESTPKG-RESISTOR0805  [TESTPKG-R0805]
R488  TESTPKG-RESISTOR0805  [TESTPKG-R0805]
R489  TESTPKG-RESISTOR0805  [TESTPKG-R0805]
R490  TESTPKG-RESISTOR0805  [TESTPKG-R0805]
R491  TESTPKG-RESISTOR0805  [TESTPKG-R0805]
R492  TESTPKG-RESISTOR0805  [TESTPKG-R0805]
R493  TESTPKG-RESISTOR0805  [TESTPKG-R0805]
R494  TESTPKG-RESISTOR0805  [TESTPKG-R0805]
R495  TESTPKG-RESISTOR0805  [TESTPKG-R0805]
R496  TESTPKG-RESISTOR0805  [TESTPKG-R0805]
R497  TESTPKG-RESISTOR0805  [TESTPKG-R0805]
R498  TESTPKG-RESISTOR0805  [TESTPKG-R0805]
R499  TESTPKG-RESISTOR0805  [TESTPKG-R0805]
R500  TESTPKG-RESISTOR0805  [TESTPKG-R0805]
R501  TESTPKG-RESISTOR0805  [TESTPKG-R0805]
R502  TESTPKG-RESISTOR0805  [TESTPKG-R0805]
R503  TESTPKG-RESISTOR0805  [TESTPKG-R0805]
R504  TESTPKG-RESISTOR0805  [TESTPKG-R0805]
R505  TESTPKG-RESISTOR0805  [TESTPKG-R0805]
R506  TESTPKG-RESISTOR0805  [TESTPKG-R0805]
R507  TESTPKG-RESISTOR0805  [TESTPKG-R0805]
R508  TESTPKG-RESISTOR0805  [TESTPKG-R0805]
R509  TESTPKG-RESISTOR0805  [TESTPKG-R0805]
R510  TESTPKG-RESISTOR0805  [TESTPKG-R0805]
R511  TESTPKG-RESISTOR0805  [TESTPKG-R0805]
R512  TESTPKG-RESISTOR0805  [TESTPKG-R0805]
R513  TESTPKG-RESISTOR0805  [TESTPKG-R0805]
R514  TESTPKG-RESISTOR0805  [TESTPKG-R0805]
R515  TESTPKG-RESISTOR0805  [TESTPKG-R0805]
R516  TESTPKG-RESISTOR0805  [TESTPKG-R0805]
R517  TESTPKG-RESISTOR0805  [TESTPKG-R0805]
R518  TESTPKG-RESISTOR0805  [TESTPKG-R0805]
R519  TESTPKG-RESISTOR0805  [TESTPKG-R0805]
R520  TESTPKG-RESISTOR0805  [TESTPKG-R0805]
R521  TESTPKG-RESISTOR0805  [TESTPKG-R0805]
R522  TESTPKG-RESISTOR0805  [TESTPKG-R0805]
R523  TESTPKG-RESISTOR0805  [TESTPKG-R0805]
R524  TESTPKG-RESISTOR0805  [TESTPKG-R0805]
R525  TESTPKG-RESISTOR0805  [TESTPKG-R0805]
R526  TESTPKG-RESISTOR0805  [TESTPKG-R0805]
R527  TESTPKG-RESISTOR0805  [TESTPKG-R0805]
R528  TESTPKG-RESISTOR0805  [TESTPKG-R0805]
R529  TESTPKG-RESISTOR0805  [TESTPKG-R0805]
R530  TESTPKG-RESISTOR0805  [TESTPKG-R0805]
R531  TESTPKG-RESISTOR0805  [TESTPKG-R0805]
R532  TESTPKG-RESISTOR0805  [TESTPKG-R0805]
R533  TESTPKG-RESISTOR0805  [TESTPKG-R0805]
R534  TESTPKG-RESISTOR0805  [TESTPKG-R0805]
R535  TESTPKG-RESISTOR0805  [TESTPKG-R0805]
R536  TESTPKG-RESISTOR0805  [TESTPKG-R0805]
R537  TESTPKG-RESISTOR0805  [TESTPKG-R0805]
R538  TESTPKG-RESISTOR0805  [TESTPKG-R0805]
R539  TESTPKG-RESISTOR0805  [TESTPKG-R0805]
R540  TESTPKG-RESISTOR0805  [TESTPKG-R0805]
R541  TESTPKG-RESISTOR0805  [TESTPKG-R0805]
R542  TESTPKG-RESISTOR0805  [TESTPKG-R0805]
R543  TESTPKG-RESISTOR0805  [TESTPKG-R0805]
R544  TESTPKG-RESISTOR0805  [TESTPKG-R0805]
R545  TESTPKG-RESISTOR0805  [TESTPKG-R0805]
R546  TESTPKG-RESISTOR0805  [TESTPKG-R0805]
R547  TESTPKG-RESISTOR0805  [TESTPKG-R0805]
R548  TESTPKG-RESISTOR0805  [TESTPKG-R0805]
R549  TESTPKG-RESISTOR0805  [TESTPKG-R0805]
R550  TESTPKG-RESISTOR0805  [TESTPKG-R0805]
R551  TESTPKG-RESISTOR0805  [TESTPKG-R0805]
R552  TESTPKG-RESISTOR0805  [TESTPKG-R0805]
R553  TESTPKG-RESISTOR0805  [TESTPKG-R0805]
R554  TESTPKG-RESISTOR0805  [TESTPKG-R0805]
R555  TESTPKG-RESISTOR0805  [TESTPKG-R0805]
R556  TESTPKG-RESISTOR0805  [TESTPKG-R0805]
R557  TESTPKG-RESISTOR0805  [TESTPKG-R0805]
R558  TESTPKG-RESISTOR0805  [TESTPKG-R0805]
R559  TESTPKG-RESISTOR0805  [TESTPKG-R0805]
R560  TESTPKG-RESISTOR0805  [TESTPKG-R0805]
R561  TESTPKG-RESISTOR0805  [TESTPKG-R0805]
R562  TESTPKG-RESISTOR0805  [TESTPKG-R0805]
R563  TESTPKG-RESISTOR0805  [TESTPKG-R0805]
R564  TESTPKG-RESISTOR0805  [TESTPKG-R0805]
R565  TESTPKG-RESISTOR0805  [TESTPKG-R0805]
R566  TESTPKG-RESISTOR0805  [TESTPKG-R0805]
R567  TESTPKG-RESISTOR0805  [TESTPKG-R0805]
R568  TESTPKG-RESISTOR0805  [TESTPKG-R0805]
R569  TESTPKG-RESISTOR0805  [TESTPKG-R0805]
R570  TESTPKG-RESISTOR0805  [TESTPKG-R0805]
R571  TESTPKG-RESISTOR0805  [TESTPKG-R0805]
R572  TESTPKG-RESISTOR0805  [TESTPKG-R0805]
R573  TESTPKG-RESISTOR0805  [TESTPKG-R0805]
R574  TESTPKG-RESISTOR0805  [TESTPKG-R0805]
R575  TESTPKG-RESISTOR0805  [TESTPKG-R0805]
R576  TESTPKG-RESISTOR0805  [TESTPKG-R0805]
R577  TESTPKG-RESISTOR0805  [TESTPKG-R0805]
R578  TESTPKG-RESISTOR0805  [TESTPKG-R0805]
R579  TESTPKG-RESISTOR0805  [TESTPKG-R0805]
R580  TESTPKG-RESISTOR0805  [TESTPKG-R0805]
R581  TESTPKG-RESISTOR0805  [TESTPKG-R0805]
R582  TESTPKG-RESISTOR0805  [TESTPKG-R0805]
R583  TESTPKG-RESISTOR0805  [TESTPKG-R0805]
R584  TESTPKG-RESISTOR0805  [TESTPKG-R0805]
R585  TESTPKG-RESISTOR0805  [TESTPKG-R0805]
R586  TESTPKG-RESISTOR0805  [TESTPKG-R0805]
R587  TESTPKG-RESISTOR0805  [TESTPKG-R0805]
R588  TESTPKG-RESISTOR0805  [TESTPKG-R0805]
R589  TESTPKG-RESISTOR0805  [TESTPKG-R0805]
R590  TESTPKG-RESISTOR0805  [TESTPKG-R0805]
R591  TESTPKG-RESISTOR0805  [TESTPKG-R0805]
R592  TESTPKG-RESISTOR0805  [TESTPKG-R0805]
R593  TESTPKG-RESISTOR0805  [TESTPKG-R0805]
R594  TESTPKG-RESISTOR0805  [TESTPKG-R0805]
R595  TESTPKG-RESISTOR0805  [TESTPKG-R0805]
R596  TESTPKG-RESISTOR0805  [TESTPKG-R0805]
R597  TESTPKG-RESISTOR0805  [TESTPKG-R0805]
R598  TESTPKG-RESISTOR0805  [TESTPKG-R0805]
R599  TESTPKG-RESISTOR0805  [TESTPKG-R0805]
R600  TESTPKG-RESISTOR0805  [TESTPKG-R0805]
R601  TESTPKG-RESISTOR0805  [TESTPKG-R0805]
R602  TESTPKG-RESISTOR0805  [TESTPKG-R0805]
R603  TESTPKG-RESISTOR0805  [TESTPKG-R0805]
R604  TESTPKG-RESISTOR0805  [TESTPKG-R0805]
R605  TESTPKG-RESISTOR0805  [TESTPKG-R0805]
R606  TESTPKG-RESISTOR0805  [TESTPKG-R0805]
R607  TESTPKG-RESISTOR0805  [TESTPKG-R0805]
R608  TESTPKG-RESISTOR0805  [TESTPKG-R0805]
R609  TESTPKG-RESISTOR0805  [TESTPKG-R0805]
R610  TESTPKG-RESISTOR0805  [TESTPKG-R0805]
R611  TESTPKG-RESISTOR0805  [TESTPKG-R0805]
R612  TESTPKG-RESISTOR0805  [TESTPKG-R0805]
R613  TESTPKG-RESISTOR0805  [TESTPKG-R0805]
R614  TESTPKG-RESISTOR0805  [TESTPKG-R0805]
R615  TESTPKG-RESISTOR0805  [TESTPKG-R0805]
R616  TESTPKG-RESISTOR0805  [TESTPKG-R0805]
R617  TESTPKG-RESISTOR0805  [TESTPKG-R0805]
R618  TESTPKG-RESISTOR0805  [TESTPKG-R0805]
R619  TESTPKG-RESISTOR0805  [TESTPKG-R0805]
R620  TESTPKG-RESISTOR0805  [TESTPKG-R0805]
R621  TESTPKG-RESISTOR0805  [TESTPKG-R0805]
R622  TESTPKG-RESISTOR0805  [TESTPKG-R0805]
R623  TESTPKG-RESISTOR0805  [TESTPKG-R0805]
R624  TESTPKG-RESISTOR0805  [TESTPKG-R0805]
R625  TESTPKG-RESISTOR0805  [TESTPKG-R0805]
R626  TESTPKG-RESISTOR0805  [TESTPKG-R0805]
R627  TESTPKG-RESISTOR0805  [TESTPKG-R0805]
R628  TESTPKG-RESISTOR0805  [TESTPKG-R0805]
R629  TESTPKG-RESISTOR0805  [TESTPKG-R0805]
R630  TESTPKG-RESISTOR0805  [TESTPKG-R0805]
R631  TESTPKG-RESISTOR0805  [TESTPKG-R0805]
R632  TESTPKG-RESISTOR0805  [TESTPKG-R0805]
R633  TESTPKG-RESISTOR0805  [TESTPKG-R0805]
R634  TESTPKG-RESISTOR0805  [TESTPKG-R0805]
R635  TESTPKG-RESISTOR0805  [TESTPKG-R0805]
R636  TESTPKG-RESISTOR0805  [TESTPKG-R0805]
R637  TESTPKG-RESISTOR0805  [TESTPKG-R0805]
R638  TESTPKG-RESISTOR0805  [TESTPKG-R0805]
R639  TESTPKG-RESISTOR0805  [TESTPKG-R0805]
R640  TESTPKG-RESISTOR0805  [TESTPKG-R0805]
R641  TESTPKG-RESISTOR0805  [TESTPKG-R0805]
R642  TESTPKG-RESISTOR0805  [TESTPKG-R0805]
R643  TESTPKG-RESISTOR0805  [TESTPKG-R0805]
R644  TESTPKG-RESISTOR0805  [TESTPKG-R0805]
R645  TESTPKG-RESISTOR0805  [TESTPKG-R0805]
R646  TESTPKG-RESISTOR0805  [TESTPKG-R0805]
R647  TESTPKG-RESISTOR0805  [TESTPKG-R0805]
R648  TESTPKG-RESISTOR0805  [TESTPKG-R0805]
R649  TESTPKG-RESISTOR0805  [TESTPKG-R0805]
R650  TESTPKG-RESISTOR0805  [TESTPKG-R0805]
R651  TESTPKG-RESISTOR0805  [TESTPKG-R0805]
R652  TESTPKG-RESISTOR0805  [TESTPKG-R0805]
R653  TESTPKG-RESISTOR0805  [TESTPKG-R0805]
R654  TESTPKG-RESISTOR0805  [TESTPKG-R0805]
R655  TESTPKG-RESISTOR0805  [TESTPKG-R0805]
R656  TESTPKG-RESISTOR0805  [TESTPKG-R0805]
R657  TESTPKG-RESISTOR0805  [TESTPKG-R0805]
R658  TESTPKG-RESISTOR0805  [TESTPKG-R0805]
R659  TESTPKG-RESISTOR0805  [TESTPKG-R0805]
R660  TESTPKG-RESISTOR0805  [TESTPKG-R0805]
R661  TESTPKG-RESISTOR0805  [TESTPKG-R0805]
R662  TESTPKG-RESISTOR0805  [TESTPKG-R0805]
R663  TESTPKG-RESISTOR0805  [TESTPKG-R0805]
R664  TESTPKG-RESISTOR0805  [TESTPKG-R0805]
R665  TESTPKG-RESISTOR0805  [TESTPKG-R0805]
R666  TESTPKG-RESISTOR0805  [TESTPKG-R0805]
R667  TESTPKG-RESISTOR0805  [TESTPKG-R0805]
R668  TESTPKG-RESISTOR0805  [TESTPKG-R0805]
R669  TESTPKG-RESISTOR0805  [TESTPKG-R0805]
R670  TESTPKG-RESISTOR0805  [TESTPKG-R0805]
R671  TESTPKG-RESISTOR0805  [TESTPKG-R0805]
R672  TESTPKG-RESISTOR0805  [TESTPKG-R0805]
R673  TESTPKG-RESISTOR0805  [TESTPKG-R0805]
R674  TESTPKG-RESISTOR0805  [TESTPKG-R0805]
R675  TESTPKG-RESISTOR0805  [TESTPKG-R0805]
R676  TESTPKG-RESISTOR0805  [TESTPKG-R0805]
R677  TESTPKG-RESISTOR0805  [TESTPKG-R0805]
R678  TESTPKG-RESISTOR0805  [TESTPKG-R0805]
R679  TESTPKG-RESISTOR0805  [TESTPKG-R0805]
R680  TESTPKG-RESISTOR0805  [TESTPKG-R0805]
R681  TESTPKG-RESISTOR0805  [TESTPKG-R0805]
R682  TESTPKG-RESISTOR0805  [TESTPKG-R0805]
R683  TESTPKG-RESISTOR0805  [TESTPKG-R0805]
R684  TESTPKG-RESISTOR0805  [TESTPKG-R0805]
R685  TESTPKG-RESISTOR0805  [TESTPKG-R0805]
R686  TESTPKG-RESISTOR0805  [TESTPKG-R0805]
R687  TESTPKG-RESISTOR0805  [TESTPKG-R0805]
R688  TESTPKG-RESISTOR0805  [TESTPKG-R0805]
R689  TESTPKG-RESISTOR0805  [TESTPKG-R0805]
R690  TESTPKG-RESISTOR0805  [TESTPKG-R0805]
R691  TESTPKG-RESISTOR0805  [TESTPKG-R0805]
R692  TESTPKG-RESISTOR0805  [TESTPKG-R0805]
R693  TESTPKG-RESISTOR0805  [TESTPKG-R0805]
R694  TESTPKG-RESISTOR0805  [TESTPKG-R0805]
R695  TESTPKG-RESISTOR0805  [TESTPKG-R0805]
R696  TESTPKG-RESISTOR0805  [TESTPKG-R0805]
R697  TESTPKG-RESISTOR0805  [TESTPKG-R0805]
R698  TESTPKG-RESISTOR0805  [TESTPKG-R0805]
R699  TESTPKG-RESISTOR0805  [TESTPKG-R0805]
R700  TESTPKG-RESISTOR0805  [TESTPKG-R0805]
R701  TESTPKG-RESISTOR0805  [TESTPKG-R0805]
R702  TESTPKG-RESISTOR0805  [TESTPKG-R0805]
R703  TESTPKG-RESISTOR0805  [TESTPKG-R0805]
R704  TESTPKG-RESISTOR0805  [TESTPKG-R0805]
R705  TESTPKG-RESISTOR0805  [TESTPKG-R0805]
R706  TESTPKG-RESISTOR0805  [TESTPKG-R0805]
R707  TESTPKG-RESISTOR0805  [TESTPKG-R0805]
R708  TESTPKG-RESISTOR0805  [TESTPKG-R0805]
R709  TESTPKG-RESISTOR0805  [TESTPKG-R0805]
R710  TESTPKG-RESISTOR0805  [TESTPKG-R0805]
R711  TESTPKG-RESISTOR0805  [TESTPKG-R0805]
R712  TESTPKG-RESISTOR0805  [TESTPKG-R0805]
TP21  CONN-TESTPOINT  [CON-TESTPOINT]
TP22  CONN-TESTPOINT  [CON-TESTPOINT]
TP23  CONN-TESTPOINT  [CON-TESTPOINT]
TP24  CONN-TESTPOINT  [CON-TESTPOINT]
TP25  CONN-TESTPOINT  [CON-TESTPOINT]
TP26  CONN-TESTPOINT  [CON-TESTPOINT]
TP27  CONN-TESTPOINT  [CON-TESTPOINT]
TP28  CONN-TESTPOINT  [CON-TESTPOINT]
TP29  CONN-TESTPOINT  [CON-TESTPOINT]
TP30  CONN-TESTPOINT  [CON-TESTPOINT]
TP31  CONN-TESTPOINT  [CON-TESTPOINT]
TP32  CONN-TESTPOINT  [CON-TESTPOINT]
TP33  CONN-TESTPOINT  [CON-TESTPOINT]
TP34  CONN-TESTPOINT  [CON-TESTPOINT]
TP35  CONN-TESTPOINT  [CON-TESTPOINT]
TP36  CONN-TESTPOINT  [CON-TESTPOINT]
TP37  CONN-TESTPOINT  [CON-TESTPOINT]
TP38  CONN-TESTPOINT  [CON-TESTPOINT]
TP39  CONN-TESTPOINT  [CON-TESTPOINT]
TP40  CONN-TESTPOINT  [CON-TESTPOINT]

### Nets
N$359: R584.2 R585.1
N$360: R698.2 R699.1
N$361: R699.2 R700.1
N$362: R700.2 R701.1
N$363: R701.2 R702.1
N$364: R702.2 R703.1
N$365: R703.2 R704.1
N$366: R704.2 R705.1
N$367: R705.2 R706.1
N$368: R706.2 R707.1
N$369: R707.2 R708.1
N$370: R708.2 R709.1
N$371: R709.2 R710.1
N$372: R710.2 R711.1
N$373: R711.2 R712.1
N$374: R679.2 R680.1
N$375: R680.2 R681.1
N$376: R681.2 R682.1
N$377: R682.2 R683.1
N$378: R683.2 R684.1
N$379: R684.2 R685.1
N$380: R685.2 R686.1
N$381: R686.2 R687.1
N$382: R687.2 R688.1
N$383: R688.2 R689.1
N$384: R689.2 R690.1
N$385: R690.2 R691.1
N$386: R691.2 R692.1
N$387: R692.2 R693.1
N$388: R693.2 R694.1
N$389: R694.2 R695.1
N$390: R695.2 R696.1 TP39.1
N$391: R697.2 R698.1
N$392: R678.2 R679.1
N$393: R661.2 R662.1
N$394: R660.2 R661.1
N$395: R662.2 R663.1
N$396: R663.2 R664.1
N$397: R664.2 R665.1
N$398: R665.2 R666.1
N$399: R666.2 R667.1
N$400: R667.2 R668.1
N$401: R668.2 R669.1
N$402: R669.2 R670.1
N$403: R670.2 R671.1
N$404: R671.2 R672.1
N$405: R672.2 R673.1
N$406: R673.2 R674.1
N$407: R674.2 R675.1
N$408: R675.2 R676.1
N$409: R676.2 R677.1 TP38.1
N$410: R659.2 R660.1
N$411: R640.2 R641.1
N$412: R641.2 R642.1
N$413: R642.2 R643.1
N$414: R643.2 R644.1
N$415: R644.2 R645.1
N$416: R645.2 R646.1
N$417: R646.2 R647.1
N$418: R647.2 R648.1
N$419: R648.2 R649.1
N$420: R649.2 R650.1
N$421: R650.2 R651.1
N$422: R651.2 R652.1
N$423: R652.2 R653.1
N$424: R653.2 R654.1
N$425: R654.2 R655.1
N$426: R655.2 R656.1
N$427: R656.2 R657.1
N$428: R657.2 R658.1 TP37.1
N$429: R622.2 R623.1
N$430: R623.2 R624.1
N$431: R624.2 R625.1
N$432: R625.2 R626.1
N$433: R626.2 R627.1
N$434: R627.2 R628.1
N$435: R628.2 R629.1
N$436: R629.2 R630.1
N$437: R630.2 R631.1
N$438: R631.2 R632.1
N$439: R632.2 R633.1
N$440: R633.2 R634.1
N$441: R634.2 R635.1
N$442: R635.2 R636.1
N$443: R636.2 R637.1
N$444: R637.2 R638.1
N$445: R638.2 R639.1 TP36.1
N$446: R621.2 R622.1
N$447: R619.2 R620.1 TP35.1
N$448: R618.2 R619.1
N$449: R617.2 R618.1
N$450: R616.2 R617.1
N$451: R615.2 R616.1
N$452: R614.2 R615.1
N$453: R613.2 R614.1
N$454: R612.2 R613.1
N$455: R611.2 R612.1
N$456: R610.2 R611.1
N$457: R609.2 R610.1
N$458: R608.2 R609.1
N$459: R607.2 R608.1
N$460: R606.2 R607.1
N$461: R605.2 R606.1
N$462: R604.2 R605.1
N$463: R603.2 R604.1
N$464: R602.2 R603.1
N$465: R600.2 R601.1 TP34.1
N$466: R599.2 R600.1
N$467: R598.2 R599.1
N$468: R597.2 R598.1
N$469: R596.2 R597.1
N$470: R595.2 R596.1
N$471: R594.2 R595.1
N$472: R593.2 R594.1
N$473: R592.2 R593.1
N$474: R591.2 R592.1
N$475: R590.2 R591.1
N$476: R589.2 R590.1
N$477: R588.2 R589.1
N$478: R587.2 R588.1
N$479: R586.2 R587.1
N$480: R585.2 R586.1
N$481: R583.2 R584.1
N$482: R581.2 R582.1 TP33.1
N$483: R580.2 R581.1
N$484: R579.2 R580.1
N$485: R578.2 R579.1
N$486: R577.2 R578.1
N$487: R576.2 R577.1
N$488: R575.2 R576.1
N$489: R574.2 R575.1
N$490: R573.2 R574.1
N$491: R572.2 R573.1
N$492: R571.2 R572.1
N$493: R570.2 R571.1
N$494: R569.2 R570.1
N$495: R568.2 R569.1
N$496: R567.2 R568.1
N$497: R566.2 R567.1
N$498: R565.2 R566.1
N$499: R564.2 R565.1
N$500: R562.2 R563.1 TP32.1
N$501: R561.2 R562.1
N$502: R560.2 R561.1
N$503: R559.2 R560.1
N$504: R558.2 R559.1
N$505: R557.2 R558.1
N$506: R556.2 R557.1
N$507: R555.2 R556.1
N$508: R554.2 R555.1
N$509: R553.2 R554.1
N$510: R552.2 R553.1
N$511: R551.2 R552.1
N$512: R550.2 R551.1
N$513: R549.2 R550.1
N$514: R548.2 R549.1
N$515: R547.2 R548.1
N$516: R546.2 R547.1
N$517: R545.2 R546.1
N$518: R543.2 R544.1 TP31.1
N$519: R542.2 R543.1
N$520: R541.2 R542.1
N$521: R540.2 R541.1
N$522: R539.2 R540.1
N$523: R538.2 R539.1
N$524: R537.2 R538.1
N$525: R536.2 R537.1
N$526: R535.2 R536.1
N$527: R533.2 R534.1
N$528: R532.2 R533.1
N$529: R531.2 R532.1
N$530: R530.2 R531.1
N$531: R529.2 R530.1
N$532: R528.2 R529.1
N$533: R527.2 R528.1
N$534: R525.2 R526.1 TP30.1
N$535: R524.2 R525.1
N$536: R523.2 R524.1
N$537: R522.2 R523.1
N$538: R521.2 R522.1
N$539: R520.2 R521.1
N$540: R519.2 R520.1
N$541: R518.2 R519.1
N$542: R517.2 R518.1
N$543: R516.2 R517.1
N$544: R515.2 R516.1
N$545: R514.2 R515.1
N$546: R513.2 R514.1
N$547: R512.2 R513.1
N$548: R511.2 R512.1
N$549: R510.2 R511.1
N$550: R509.2 R510.1
N$551: R508.2 R509.1
N$552: R506.2 R507.1 TP29.1
N$553: R505.2 R506.1
N$554: R504.2 R505.1
N$555: R503.2 R504.1
N$556: R502.2 R503.1
N$557: R501.2 R502.1
N$558: R500.2 R501.1
N$559: R499.2 R500.1
N$560: R498.2 R499.1
N$561: R497.2 R498.1
N$562: R496.2 R497.1
N$563: R495.2 R496.1
N$564: R494.2 R495.1
N$565: R493.2 R494.1
N$566: R492.2 R493.1
N$567: R491.2 R492.1
N$568: R490.2 R491.1
N$569: R489.2 R490.1
N$570: R487.2 R488.1 TP28.1
N$571: R486.2 R487.1
N$572: R485.2 R486.1
N$573: R484.2 R485.1
N$574: R483.2 R484.1
N$575: R482.2 R483.1
N$576: R481.2 R482.1
N$577: R480.2 R481.1
N$578: R479.2 R480.1
N$579: R478.2 R479.1
N$580: R477.2 R478.1
N$581: R476.2 R477.1
N$582: R475.2 R476.1
N$583: R474.2 R475.1
N$584: R473.2 R474.1
N$585: R472.2 R473.1
N$586: R471.2 R472.1
N$587: R470.2 R471.1
N$588: R468.2 R469.1 TP27.1
N$589: R467.2 R468.1
N$590: R466.2 R467.1
N$591: R465.2 R466.1
N$592: R464.2 R465.1
N$593: R463.2 R464.1
N$594: R462.2 R463.1
N$595: R461.2 R462.1
N$596: R460.2 R461.1
N$597: R459.2 R460.1
N$598: R458.2 R459.1
N$599: R457.2 R458.1
N$600: R456.2 R457.1
N$601: R455.2 R456.1
N$602: R454.2 R455.1
N$603: R453.2 R454.1
N$604: R452.2 R453.1
N$605: R451.2 R452.1
N$606: R449.2 R450.1 TP26.1
N$607: R448.2 R449.1
N$608: R447.2 R448.1
N$609: R446.2 R447.1
N$610: R445.2 R446.1
N$611: R444.2 R445.1
N$612: R443.2 R444.1
N$613: R442.2 R443.1
N$614: R441.2 R442.1
N$615: R440.2 R441.1
N$616: R439.2 R440.1
N$617: R438.2 R439.1
N$618: R437.2 R438.1
N$619: R436.2 R437.1
N$620: R435.2 R436.1
N$621: R434.2 R435.1
N$622: R433.2 R434.1
N$623: R432.2 R433.1
N$624: R429.2 R430.1
N$625: R428.2 R429.1
N$626: R427.2 R428.1
N$627: R426.2 R427.1
N$628: R425.2 R426.1
N$629: R424.2 R425.1
N$630: R423.2 R424.1
N$631: R422.2 R423.1
N$632: R421.2 R422.1
N$633: R420.2 R421.1
N$634: R419.2 R420.1
N$635: R418.2 R419.1
N$636: R417.2 R418.1
N$637: R416.2 R417.1
N$638: R415.2 R416.1
N$639: R414.2 R415.1
N$640: R413.2 R414.1
N$641: R410.2 R411.1
N$642: R409.2 R410.1
N$643: R408.2 R409.1
N$644: R407.2 R408.1
N$645: R406.2 R407.1
N$646: R405.2 R406.1
N$647: R404.2 R405.1
N$648: R403.2 R404.1
N$649: R402.2 R403.1
N$650: R401.2 R402.1
N$651: R400.2 R401.1
N$652: R399.2 R400.1
N$653: R398.2 R399.1
N$654: R397.2 R398.1
N$655: R396.2 R397.1
N$656: R395.2 R396.1
N$657: R394.2 R395.1
N$658: R391.2 R392.1
N$659: R390.2 R391.1
N$660: R389.2 R390.1
N$661: R388.2 R389.1
N$662: R387.2 R388.1
N$663: R386.2 R387.1
N$664: R385.2 R386.1
N$665: R384.2 R385.1
N$666: R383.2 R384.1
N$667: R382.2 R383.1
N$668: R381.2 R382.1
N$669: R380.2 R381.1
N$670: R379.2 R380.1
N$671: R378.2 R379.1
N$672: R377.2 R378.1
N$673: R376.2 R377.1
N$674: R375.2 R376.1
N$675: R372.2 R373.1
N$676: R371.2 R372.1
N$677: R370.2 R371.1
N$678: R369.2 R370.1
N$679: R368.2 R369.1
N$680: R367.2 R368.1
N$681: R366.2 R367.1
N$682: R365.2 R366.1
N$683: R364.2 R365.1
N$684: R363.2 R364.1
N$685: R362.2 R363.1
N$686: R361.2 R362.1
N$687: R360.2 R361.1
N$688: R359.2 R360.1
N$689: R358.2 R359.1
N$690: R179.2 R358.1
N$691: R374.2 R375.1
N$692: R393.2 R394.1
N$693: R412.2 R413.1
N$694: R431.2 R432.1
N$695: R450.2 R451.1
N$696: R469.2 R470.1
N$697: R488.2 R489.1
N$698: R507.2 R508.1
N$699: R526.2 R527.1
N$700: R544.2 R545.1
N$701: R563.2 R564.1
N$702: R582.2 R583.1
N$703: R601.2 R602.1
N$704: R620.2 R621.1
N$705: R639.2 R640.1
N$706: R658.2 R659.1
N$707: R677.2 R678.1
N$708: R696.2 R697.1
N$709: R430.2 R431.1 TP25.1
N$710: R411.2 R412.1 TP24.1
N$711: R392.2 R393.1 TP23.1
N$712: R373.2 R374.1 TP22.1
N$713: R534.2 R535.1
N$714: R712.2 TP40.1
N$715: R179.1 TP21.1

### Notes on the sheet
- 0805 - BOTTOM SIDE

## Library data of the parts
FID1-FID10 = FirePick:FIDUCIAL
R1-R28 R30-R712 = TinWhiskers:TESTPKG-RESISTOR
R29 = TinWhiskers:CPL-RES-0603-0-0.1W: Resistor: 0 Ohm, 0.1W, 5%; Specs: http://www.mouser.com/ds/2/315/AOA0000CE1-37422.pdf
TP1-TP40 = FirePick:CONN-TESTPOINT